# EAGLE schematic AtmelSMD328NRF (EAGLE 7.1.0)
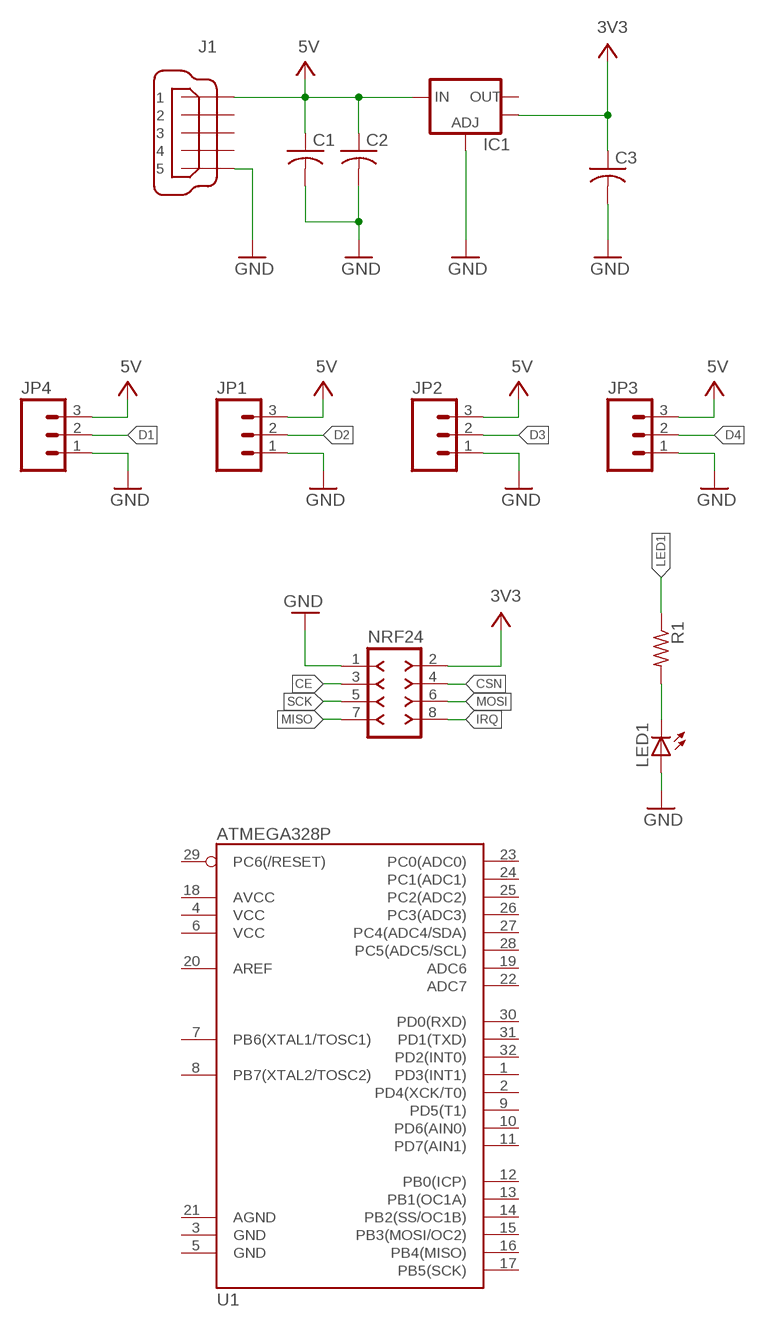
[diagram p0: schematic, sheet 1]

## Parts
C1  C-USC0805  [C0805]
C2  C-USC0805  [C0805]
C3  C-USC0805  [C0805]
IC1  V_REG_LM1117SOT223  [SOT223]
J1  MICRO-USB-ZX62R-B-5P  [ZX62R-B-5P]
JP1  M03PTH  [1X03]
JP2  M03PTH  [1X03]
JP3  M03PTH  [1X03]
JP4  M03PTH  [1X03]
LED1  LEDCHIPLED_0805  [CHIPLED_0805]
NRF24  F-2X04-DIL-100  [DIL-100-2X04]
R1  R-US_R0805  [R0805]
U1  ATMEGA328P  ATMEGA328_SMT  [TQFP32-08]

## Nets
+3V3: C3.1 IC1.4(OUT) NRF24.2 ; supply symbol labelled 3V3
+5V: C1.1 C2.1 IC1.3(IN) J1.1 JP1.3 JP2.3 JP3.3 JP4.3 ; supply symbol labelled 5V
CE: NRF24.3
CSN: NRF24.4
D1: JP4.2
D2: JP1.2
D3: JP2.2
D4: JP3.2
GND: C1.2 C2.2 C3.2 IC1.1(ADJ) J1.5 JP1.1 JP2.1 JP3.1 JP4.1 LED1.A NRF24.1
IRQ: NRF24.8
LED1: R1.1
MISO: NRF24.7
MOSI: NRF24.6
N$9: LED1.C R1.2
SCK: NRF24.5
Unconnected: IC1.2(OUT) J1.2 J1.3 J1.4 U1.1(PD3(INT1)) U1.2(PD4(XCK/T0)) U1.3(GND) U1.4(VCC) U1.5(GND) U1.6(VCC) U1.7(PB6(XTAL1/TOSC1)) U1.8(PB7(XTAL2/TOSC2)) U1.9(PD5(T1)) U1.10(PD6(AIN0)) U1.11(PD7(AIN1)) U1.12(PB0(ICP)) U1.13(PB1(OC1A)) U1.14(PB2(SS/OC1B)) U1.15(PB3(MOSI/OC2)) U1.16(PB4(MISO)) U1.17(PB5(SCK)) U1.18(AVCC) U1.19(ADC6) U1.20(AREF) U1.21(AGND) U1.22(ADC7) U1.23(PC0(ADC0)) U1.24(PC1(ADC1)) U1.25(PC2(ADC2)) U1.26(PC3(ADC3)) U1.27(PC4(ADC4/SDA)) U1.28(PC5(ADC5/SCL)) U1.29(PC6(/RESET)) U1.30(PD0(RXD)) U1.31(PD1(TXD)) U1.32(PD2(INT0))

## Library data of the parts
C1-C3 = resistor:C-US: CAPACITOR, American symbol
IC1 = sparkFun-PowerIC:V_REG_LM1117: Voltage Regulator LM1117 Standard adjustable voltage regulator but in SMD form. Spark Fun Electronics SKU : COM-00595; PROD_ID: VREG-08170
J1 = con-hirose2:MICRO-USB-: Hirose Micro USB Connector ZX62R-B-5P: Micro B, reverse (top mount) shell SMT Supplier: DigiKey H11574CT-ND Source: http://www.hirose.co.jp/cataloge_hp/e24200011.pdf
JP1-JP4 = sparkFun-Connectors:M03: Header 3 Standard 3-pin 0.1" header. Use with straight break away headers (SKU : PRT-00116), right angle break away headers (PRT-00553), swiss pins (PRT-00743), machine pins (PRT-00117), and female headers (PRT-00115). Molex polarized connector foot print use with SKU : PRT-08232 with associated crimp pins and housings.
LED1 = adafruit:LED: LED OSRAM: - CHIPLED LG R971, LG N971, LY N971, LG Q971, LY Q971, LO R971, LY R971 LH N974, LH R974 LS Q976, LO Q976, LY Q976 LO Q996 - Hyper CHIPLED LW Q18S LB Q993, LB Q99A, LB R99A - SideLED LS A670, LO A670, LY A670, LG A670, LP A670 LB A673, LV A673, LT A673, LW A673 LH A674 LY A675 LS A676, LA A676, LO A676, LY A676, LW A676 LS A679, LY A679, LG A679 - Hyper Micro SIDELED� LS Y876, LA Y876, LO Y876, LY Y876 LT Y87S - SmartLED LW L88C, LW L88S LB L89C, LB L89S, LG L890 LS L89K, LO L89K, LY L89K LS L896, LA L896, LO L896, LY L896 - TOPLED LS T670, LO T670, LY T670, LG T670, LP T670 LSG T670, LSP T670, LSY T670, LOP T670, LYG T670 LG T671, LOG T671, LSG T671 LB T673, LV T673, LT T673, LW T673 LH T674 LS T676, LA T676, LO T676, LY T676, LB T676, LH T676, LSB T676, LW T676 LB T67C, LV T67C, LT T67C, LS T67K, LO T67K, LY T67K, LW E67C LS E67B, LA E67B, LO E67B, LY E67B, LB E67C, LV E67C, LT E67C LW T67C LS T679, LY T679, LG T679 LS T770, LO T770, LY T770, LG T770, LP T770 LB T773, LV T773, LT T773, LW T773 LH T774 LS E675, LA E675, LY E675, LS T675 LS T776, LA T776, LO T776, LY T776, LB T776 LHGB T686 LT T68C, LB T68C - Hyper Mini TOPLED� LB M676 - Mini TOPLED Santana� LG M470 LS M47K, LO M47K, LY M47K Source: http://www.osram.convergy.de/
NRF24 = con-headers-jp:F-2X04-: FEMALE HEADER
R1 = resistor:R-US_: RESISTOR, American symbol
U1 = sparkFun-DigitalIC:ATMEGA328_SMT: 32-Pin Atmega328 part Commonly used on Arduino compatible boards Available in QFP and QFN packages TQFP is IC-09069 QFN is non-stock; PROD_ID: IC-09069